# EAGLE design waer level (EAGLE 9.6.2)
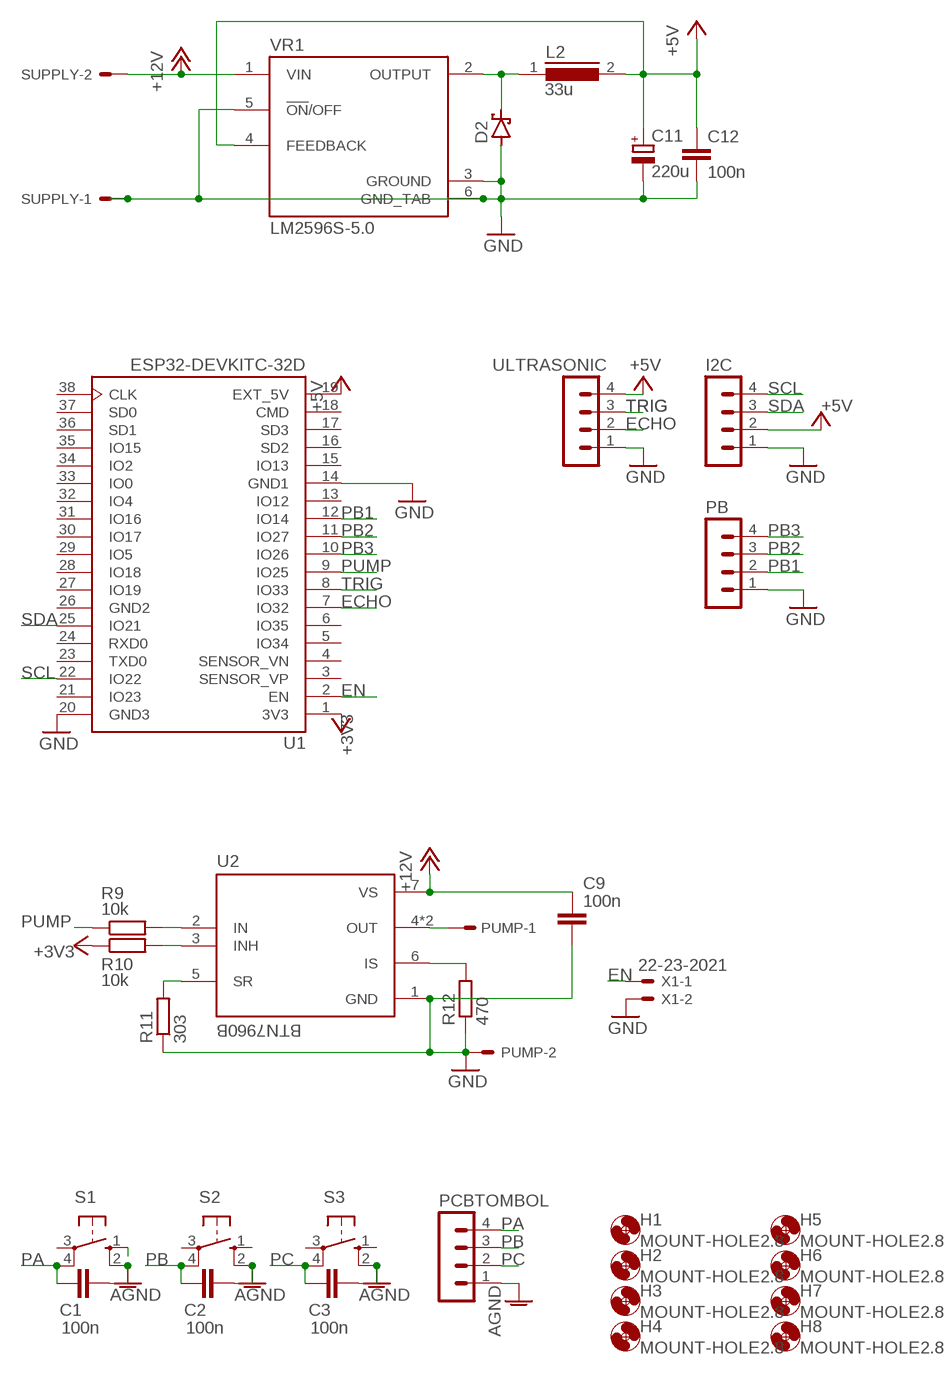
[diagram p0: schematic, sheet 1]

## Parts
C1  100n  C-EUC0805  [C0805]
C2  100n  C-EUC0805  [C0805]
C3  100n  C-EUC0805  [C0805]
C9  100n  C-EUC0805  [C0805]
C11  220u  CPOL-EU153CLV-0605  [153CLV-0605]
C12  100n  C-EUC0805  [C0805]
D2  SCHOTTKY-DIODESMD  [SMB]
H1  MOUNT-HOLE2.8  [2,8]
H2  MOUNT-HOLE2.8  [2,8]
H3  MOUNT-HOLE2.8  [2,8]
H4  MOUNT-HOLE2.8  [2,8]
H5  MOUNT-HOLE2.8  [2,8]
H6  MOUNT-HOLE2.8  [2,8]
H7  MOUNT-HOLE2.8  [2,8]
H8  MOUNT-HOLE2.8  [2,8]
I2C  MA04-1  [MA04-1]
L2  33u  DR125  [DR125]
PB  MA04-1  [MA04-1]
PCBTOMBOL  MA04-1  [MA04-1]
PUMP  KK-156-2  [KK-156-2]
R9  10k  R-EU_R0805  [R0805]
R10  10k  R-EU_R0805  [R0805]
R11  303  R-EU_R0805  [R0805]
R12  470  R-EU_R0805  [R0805]
S1  40-XX  [B3F-40XX]
S2  40-XX  [B3F-40XX]
S3  40-XX  [B3F-40XX]
SUPPLY  KK-156-2  [KK-156-2]
U1  ESP32-DEVKITC-32D  [MODULE_ESP32-DEVKITC-32D]
U2  BTN7960B  [IC_BTN7960B]
ULTRASONIC  MA04-1  [MA04-1]
VR1  LM2596S-5.0  [TO170P1524X483-6N]
X1  22-23-2021  [22-23-2021]

## Nets
+3V3 [24]: R10.1 U1.1(3V3)
+5V: C11.+ C12.1 I2C.2 L2.2 U1.19(EXT_5V) ULTRASONIC.4 VR1.4(FEEDBACK)
+12V: C9.1 SUPPLY.2 U2.7(VS) VR1.1(VIN)
AGND: C1.2 C2.2 C3.2 PCBTOMBOL.1 S1.2(S1) S2.2(S1) S3.2(S1)
ECHO: U1.7(IO32) ULTRASONIC.2
EN: U1.2(EN) X1.1
GND: C9.2 C11.- C12.2 D2.A I2C.1 PB.1 PUMP.2 R11.1 R12.1 SUPPLY.1 U1.14(GND1) U1.20(GND3) U2.1(GND) ULTRASONIC.1 VR1.3(GROUND) VR1.5(!ON!/OFF) VR1.6(GND_TAB) X1.2
N$2: S1.1(S)
N$5: R9.2 U2.2(IN)
N$6: R10.2 U2.3(INH)
N$7 [24]: D2.C L2.1 VR1.2(OUTPUT)
N$8: R11.2 U2.5(SR)
N$12: R12.2 U2.6(IS)
N$17: PUMP.1 U2.4(OUT) U2.8(OUT)
PA: C1.1 PCBTOMBOL.4 S1.4(P1)
PB: C2.1 PCBTOMBOL.3 S2.4(P1)
PB1: PB.2 U1.12(IO14)
PB2: PB.3 U1.11(IO27)
PB3: PB.4 U1.10(IO26)
PC: C3.1 PCBTOMBOL.2 S3.4(P1)
PUMP: R9.1 U1.9(IO25)
SCL: I2C.4 U1.22(IO22)
SDA: I2C.3 U1.25(IO21)
TRIG: U1.8(IO33) ULTRASONIC.3
Unconnected: S1.3(P) S2.1(S) S2.3(P) S3.1(S) S3.3(P) U1.3(SENSOR_VP) U1.4(SENSOR_VN) U1.5(IO34) U1.6(IO35) U1.13(IO12) U1.15(IO13) U1.16(SD2) U1.17(SD3) U1.18(CMD) U1.21(IO23) U1.23(TXD0) U1.24(RXD0) U1.27(IO19) U1.28(IO18) U1.29(IO5) U1.30(IO17) U1.31(IO16) U1.32(IO4) U1.33(IO0) U1.34(IO2) U1.35(IO15) U1.36(SD1) U1.37(SD0) U1.38(CLK)

## Power pins joined to a net without a drawn wire
GND2: U1.26(GND2)

## Library data of the parts
C1-C3 C9 C12 = rcl:C-EU: CAPACITOR, European symbol; SPICEPREFIX: C
C11 = rcl:CPOL-EU: POLARIZED CAPACITOR, European symbol; SPICEPREFIX: C
D2 = diode:SCHOTTKY-DIODE: Schottky Diode
H1-H8 = holes:MOUNT-HOLE: MOUNTING HOLE with drill center marker
I2C PB PCBTOMBOL ULTRASONIC = con-lstb:MA04-1: PIN HEADER; OC_FARNELL: unknown; OC_NEWARK: unknown
L2 = inductors:DR125: High Power Density, High Efficiency, Shielded Inductors Source: coiltronics_dr_series.pdf; SPICEPREFIX: L
PUMP SUPPLY = con-molex:KK-156-2: KK 156 HEADER Source: http://www.molex.com/pdm_docs/sd/026604100_sd.pdf; MF: MOLEX; OC_FARNELL: unknown; OC_NEWARK: unknown
R9-R12 = rcl:R-EU_: RESISTOR, European symbol; SPICEPREFIX: R
S1-S3 = switch-omron:40-XX: OMRON SWITCH; MF: OMRON COMPONENTS USA; MPN: B3F-4000; OC_FARNELL: 176434; OC_NEWARK: 36K3105
U1 = ESP32-DEVKITC-32D:ESP32-DEVKITC-32D: Eval Board For Esp-Wroom-32 Check availability <https://pricing.snapeda.com/parts/ESP32-DEVKITC-32D/Espressif%20Systems/view-part?ref=eda>; AVAILABILITY: In Stock; DESCRIPTION: WiFi Development Tools (802.11) ESP32 General Development Kit, ESP32-WROOM-32D on the board; MF: Espressif Systems; MP: ESP32-DEVKITC-32D; PACKAGE: None; PRICE: None; PURCHASE-URL: https://pricing.snapeda.com/search/part/ESP32-DEVKITC-32D/?ref=eda
U2 = BTN7960B:BTN7960B: Motor Driver Power MOSFET On/Off PG-TO263-7 Check prices <https://pricing.snapeda.com/parts/BTN7960B/Infineon%20Technologies/view-part?ref=eda>; AVAILABILITY: Bad; DESCRIPTION: Motor Driver Power MOSFET On/Off PG-TO263-7; MF: Infineon Technologies; MP: BTN7960B; PACKAGE: TO-263-8 Infineon Technologies; PRICE: None
VR1 = LM2596S-5.0:LM2596S-5.0: Check prices <https://pricing.snapeda.com/parts/LM2596S-5.0/NOPB/Texas%20Instruments/view-part?ref=eda>; AVAILABILITY: Good; DESCRIPTION: SIMPLE SWITCHER&reg; 4.5V to 40V, 3A Low Component Count Step-Down Regulator 5-DDPAK/TO-263; MF: Texas Instruments; MP: LM2596S-5.0/NOPB; PACKAGE: TO-263-5 Texas Instruments; PRICE: None; PURCHASE-URL: https://pricing.snapeda.com/search/part/LM2596S-5.0/NOPB/?ref=eda
X1 = con-molex:22-23-2021: .100" (2.54mm) Center Header - 2 Pin; MF: MOLEX; MPN: 22-23-2021; OC_FARNELL: 1462926; OC_NEWARK: 25C3832

## Board
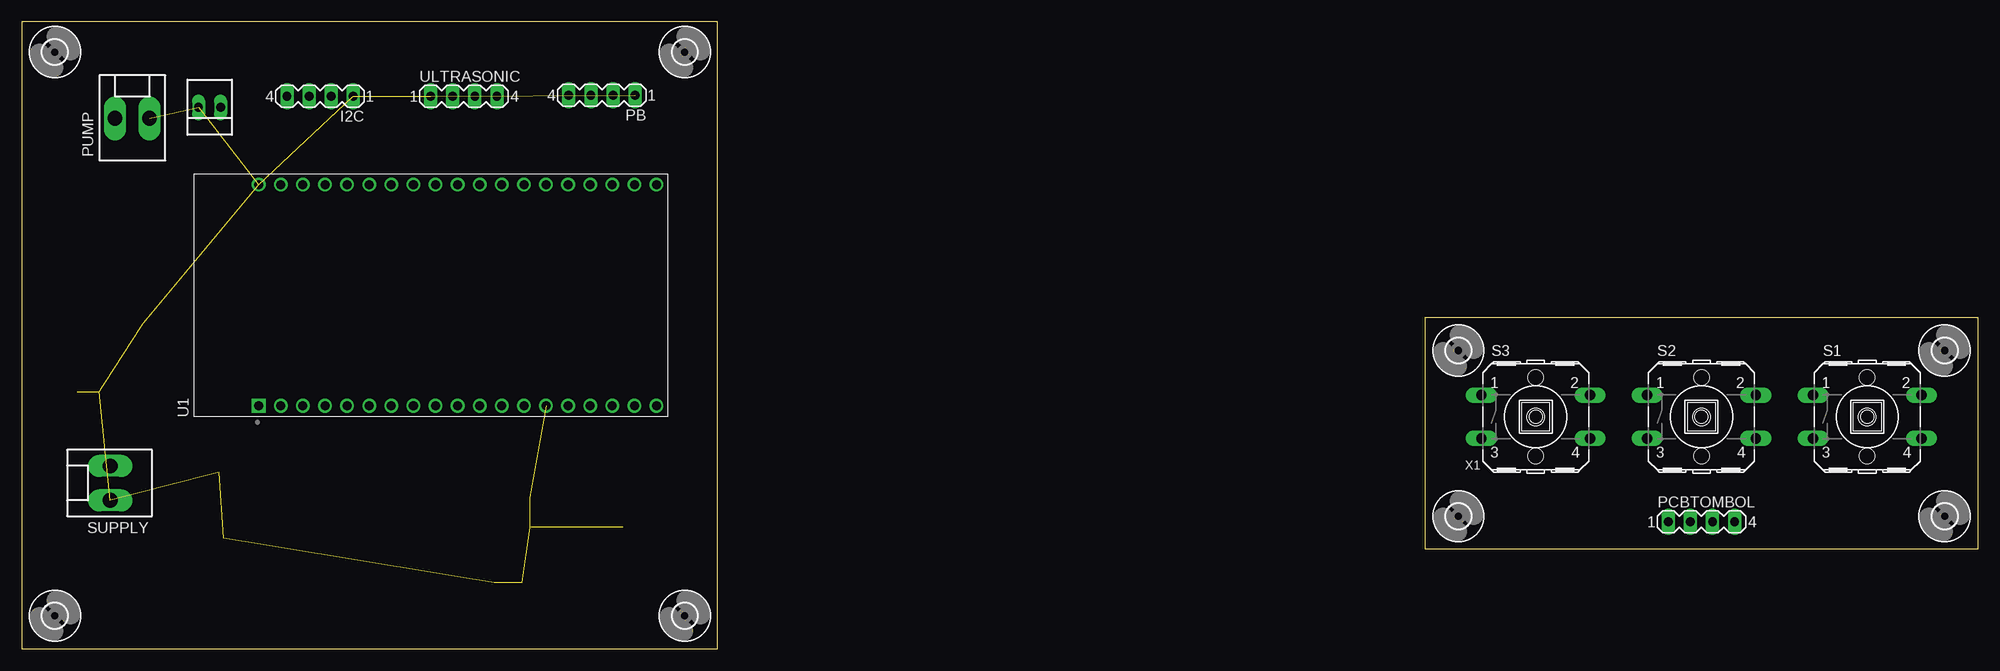
[diagram p1: board, top side]
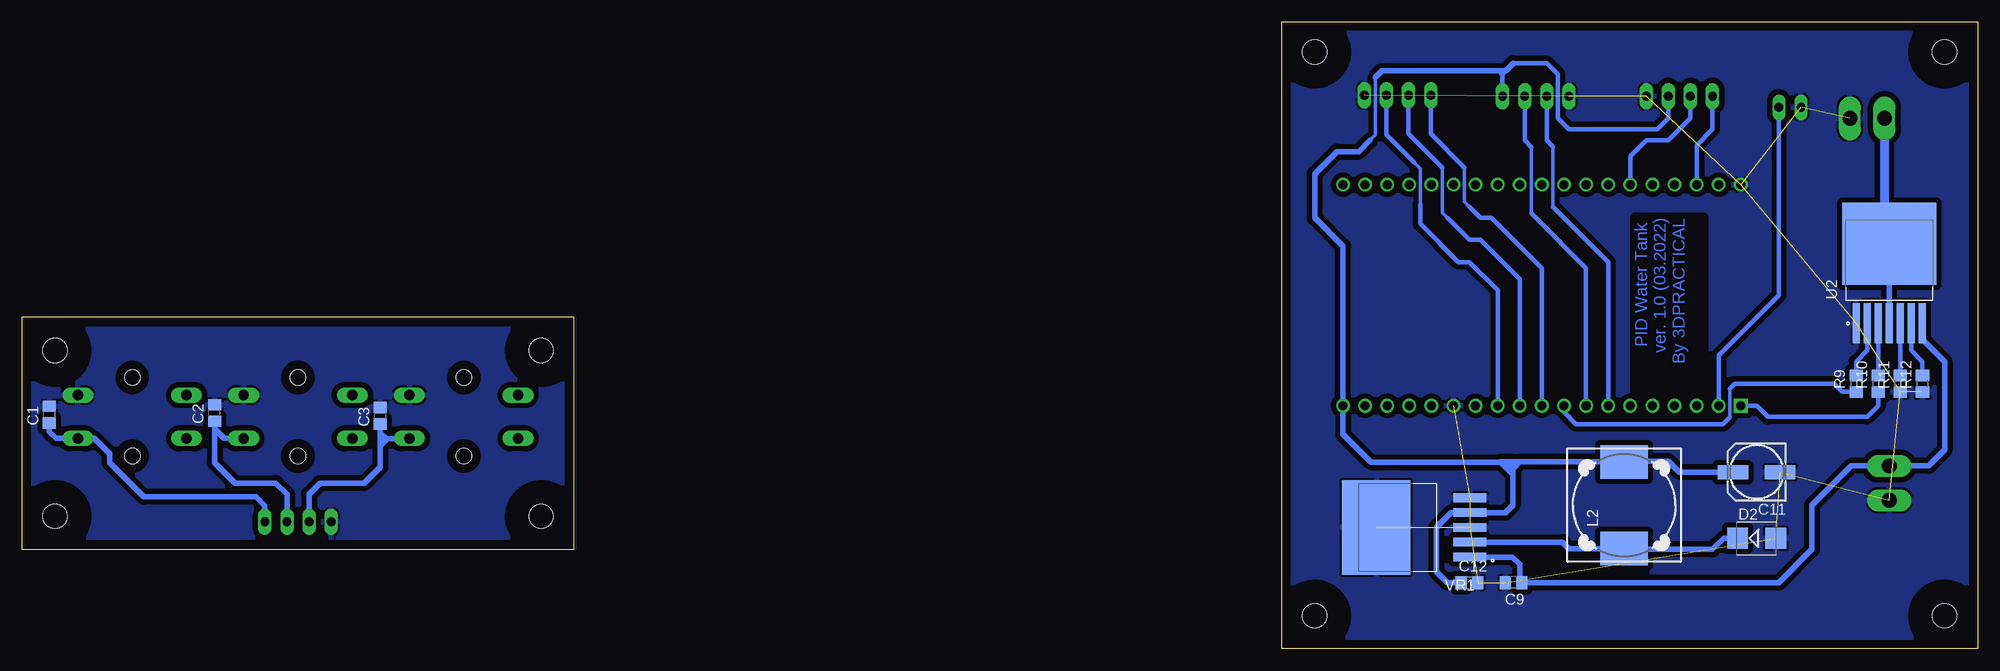
[diagram p2: board, bottom side, seen from below]

Size 224.79 x 72.06 mm. Coordinates in mm from the lower left corner, seen from the top.
Outline: 0,0 79.99,0 79.99,72.06 0,72.06 0,0
Outline: 161.29,38.1 224.79,38.1 224.79,11.43 161.29,11.43 161.29,38.1
Copper layers (1*16): Top 0.035mm / dielectric 1.5mm / Bottom 0.035mm
Design rules "default": minimum track width 6mil, minimum drill 0.35mm, track to track 6mil, track to pad 6mil, pad to pad 6mil, via to via 6mil, smd to smd 6mil, copper to edge 40mil, drill to drill 6mil, minimum pad ring 10mil, minimum via ring 8mil, stop-mask expansion 4mil, vias tented up to drill 0mil, thermal gap 10mil

### Footprints (pad centres in the part's own frame; a part is rotated, then mirrored left to right if it is on the bottom)
C0805 = smd 1.3 x 1.5: 1 -0.95,0; 2 0.95,0
153CLV-0605 = smd 3.5 x 1.6: + 2.7,0; - -2.7,0
SMB = smd 2.4 x 2.4: A 2.2,0; C -2.2,0
2,8 = hole 2.8: 0,0
MA04-1 = drill 1.016 long: 1 -3.81,0; 2 -1.27,0; 3 1.27,0; 4 3.81,0
DR125 = smd 3.85 x 5.5: 1 -4.975,0; 2 4.975,0
KK-156-2 = drill 1.7 pad 2.184 long: 1 -1.98,0; 2 1.98,0
R0805 = smd 1.3 x 1.5: 1 -0.95,0; 2 0.95,0
B3F-40XX = drill 1.194 long: 1 -6.248,2.489; 2 6.248,2.489; 3 -6.248,-2.489; 4 6.248,-2.489 | hole 1.803: 0,-4.496; 0,4.496
MODULE_ESP32-DEVKITC-32D = drill 1.04 square: 1 -12.7,19.76 | drill 1.04: 2 -12.7,17.22; 3 -12.7,14.68; 4 -12.7,12.14; 5 -12.7,9.6; 6 -12.7,7.06; 7 -12.7,4.52; 8 -12.7,1.98; 9 -12.7,-0.56; 10 -12.7,-3.1; 11 -12.7,-5.64; 12 -12.7,-8.18; 13 -12.7,-10.72; 14 -12.7,-13.26; 15 -12.7,-15.8; 16 -12.7,-18.34; 17 -12.7,-20.88; 18 -12.7,-23.42; 19 -12.7,-25.96; 20 12.7,19.76; 21 12.7,17.22; 22 12.7,14.68; 23 12.7,12.14; 24 12.7,9.6; 25 12.7,7.06; 26 12.7,4.52; 27 12.7,1.98; 28 12.7,-0.56; 29 12.7,-3.1; 30 12.7,-5.64; 31 12.7,-8.18; 32 12.7,-10.72; 33 12.7,-13.26; 34 12.7,-15.8; 35 12.7,-18.34; 36 12.7,-20.88; 37 12.7,-23.42; 38 12.7,-25.96
IC_BTN7960B = smd 4.6 x 0.8: 1 -5.775,3.81; 2 -5.775,2.54; 3 -5.775,1.27; 4 -5.775,0; 5 -5.775,-1.27; 6 -5.775,-2.54; 7 -5.775,-3.81 | smd 9.4 x 10.8: 8 3.375,0
TO170P1524X483-6N = smd 3.79 x 0.99: 1 -6.4,3.4; 2 -6.4,1.7; 3 -6.4,0; 4 -6.4,-1.7; 5 -6.4,-3.4 | smd 7.88 x 10.84: 6 4.35,0
22-23-2021 = drill 1 long: 1 -1.27,0; 2 1.27,0

### Placement (x,y rotation side)
C1  221.62,26.92 90 bottom
C2  202.63,27.11 90 bottom
C3  183.58,26.8 90 bottom
C9  53.34,7.62 180 bottom
C11  25.4,20.32 180 bottom
C12  58.42,7.62 0 bottom
D2  25.4,12.7 0 bottom
H1  3.81,3.81 0 top
H2  76.2,3.81 0 top
H3  76.2,68.58 0 top
H4  3.81,68.58 0 top
H5  165.1,34.29 0 top
H6  165.1,15.24 0 top
H7  220.98,15.24 0 top
H8  220.98,34.29 0 top
I2C  34.29,63.5 180 top
L2  40.64,16.51 90 bottom
PB  66.67,63.63 180 top
PCBTOMBOL  193.04,14.61 0 top
PUMP  12.7,60.96 0 top
R9  13.97,30.48 90 bottom
R10  11.43,30.48 90 bottom
R11  8.89,30.48 90 bottom
R12  6.35,30.48 90 bottom
S1  212.09,26.67 0 top
S2  193.04,26.67 0 top
S3  173.99,26.67 0 top
SUPPLY  10.16,19.05 90 top
U1  46.99,40.64 90 top
U2  10.16,43.18 90 bottom
ULTRASONIC  50.8,63.5 0 top
VR1  64.77,13.97 180 bottom
X1  21.59,62.23 180 top

### Tracks (layer width: path | path; a pad name or v marks a point on that pad's centre or on a via)
+3V3
  Bottom 0.508: R10.1 11.43,27.94 12.7,26.67 24.13,26.67 25.4,27.94 U1.1
+5V
  Bottom 0.406: 69.85,58.42 69.21,59.06 69.21,65.66
  Bottom 0.508: ULTRASONIC.4 54.61,66.04 53.34,67.31 49.53,67.31 48.26,66.04 48.26,60.96 46.99,59.69 36.83,59.69 35.56,60.96 I2C.2
  Bottom 0.61: C11.+ 34.29,20.32 35.56,21.59 40.64,21.59 L2.2 52.6,21.48 | 53.44,21.48 54.86,21.48 53.44,20.07 | 53.44,21.48 53.34,21.48 52.6,21.48 | C12.1 60.96,7.62 62.23,8.89 62.23,13.97 60.53,15.67 VR1.4 54.28,15.67 53.44,16.51 53.44,20.07 | 53.44,21.48 53.44,20.64 52.6,21.48 | 53.44,20.07 53.44,20.43 54.48,21.46 69.72,21.46 72.95,24.69 U1.19 72.95,46.28 76.2,49.53 76.2,54.61 73.66,57.15 71.12,57.15 69.85,58.42 | 69.21,65.66 68.45,66.42 54.99,66.42 | 53.34,67.31 54.23,66.42 54.99,66.42 | 54.61,66.04 54.99,66.42
+12V
  Bottom 0.61: U2.7 6.35,35.56 3.81,33.02 3.81,22.86 5.64,21.03 SUPPLY.2 14.53,21.03 19.05,16.51 19.05,11.43 22.86,7.62 C9.1 52.64,7.87 52.64,9.72 53.47,10.54 58.34,10.54 VR1.1
AGND
  pour Bottom (isolate 0.61): 161.29,38.1 224.79,38.1 224.79,11.43 161.29,11.43
ECHO
  Bottom 0.406: 48.83,50.81 48.83,57.72
  Bottom 0.508: 48.83,50.81 48.54,50.52 42.47,44.45 U1.7 | 48.83,57.72 49.53,58.42 ULTRASONIC.2
EN
  Bottom 0.508: X1.1 22.86,40.64 29.77,33.73 U1.2
GND  (17 unrouted)
  pour Bottom (isolate 0.61): 0,72.07 80.01,72.07 80.01,0 0,0
N$5
  Bottom 0.508: U2.2 12.7,34.29 13.97,33.02 R9.2
N$6
  Bottom 0.508: U2.3 R10.2
N$7
  Bottom 0.61: L2.1 41.61,11.54 | VR1.2 47.72,12.27 46.99,11.54 41.61,11.54 | D2.C 29.21,12.7 30.48,11.43 39.46,11.43 40.27,12.24 40.9,12.24 41.61,11.54
N$8
  Bottom 0.508: U2.5 R11.2
N$12
  Bottom 0.508: U2.6 7.62,34.29 6.35,33.02 R12.2
N$17
  Bottom 0.61: U2.4 U2.8
  Bottom 1.016: PUMP.1 10.72,47.12 U2.8
PA
  Bottom 0.61: PCBTOMBOL.4 196.85,16.45 197.87,17.46 210.76,17.46 214.69,21.4 214.69,22.42 216.46,24.18 S1.4 220.84,24.18 221.62,24.96 C1.1
PB
  Bottom 0.61: S2.4 201.54,24.18 202.63,25.27 C2.1 202.63,21.4 200.28,19.05 195.58,19.05 194.31,17.78 PCBTOMBOL.3
PB1
  Bottom 0.406: 64.07,51.12 64.07,55.18 64.77,55.88
  Bottom 0.508: U1.12 55.17,41.2 58.42,44.45 59.69,44.45 64.07,48.83 64.07,51.12 | 64.77,55.88 67.94,59.06 PB.2
PB2
  Bottom 0.406: 60.96,49.53 61.53,50.1 61.53,55.31
  Bottom 0.508: U1.11 52.63,42.47 57.15,46.99 58.42,46.99 60.96,49.53 | PB.3 65.41,59.18 61.53,55.31
PB3
  Bottom 0.406: 58.42,50.8 58.99,51.37 58.99,55.31
  Bottom 0.508: U1.10 50.09,43.74 55.88,49.53 57.15,49.53 58.42,50.8 | 58.99,55.31 62.86,59.18 PB.4
PC
  Bottom 0.61: C3.1 183.58,24.83 | 183.58,24.83 182.88,24.13 | 182.88,24.13 180.29,24.13 S3.4 | 183.58,24.83 183.58,23.37 | 183.58,23.37 183.58,20.89 185.42,19.05 190.5,19.05 191.77,17.78 PCBTOMBOL.2 | 182.88,24.13 182.88,24.07 183.58,23.37
PUMP
  Bottom 0.406: 28.51,26.61 28.51,29.91
  Bottom 0.508: R9.1 15.56,29.53 16.51,30.48 27.94,30.48 28.51,29.91 | 28.51,26.61 29.27,25.85 46.16,25.85 47.55,27.23 U1.9
SCL
  Bottom 0.508: U1.22 32.31,57.86 30.48,59.69 I2C.4
SDA
  Bottom 0.508: I2C.3 33.02,60.96 35.56,58.42 38.1,58.42 39.93,56.59 U1.25
TRIG
  Bottom 0.406: 51.31,50.04 51.31,57.66
  Bottom 0.508: U1.8 45.01,43.74 50.8,49.53 51.31,50.04 | 51.31,57.66 52.07,58.42 ULTRASONIC.3

### Text on the board
Bottom: PID Water Tank / ver. 1.0 (03.2022) / By 3DPRACTICAL